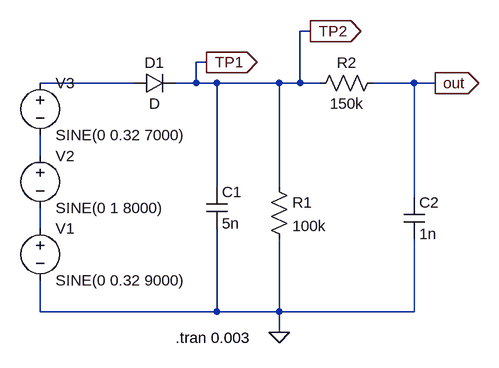
[diagram p0: schematic demodulator.asc]
demodulator.asc, the LTspice schematic file:
Version 4
SHEET 1 880 680
WIRE 544 -480 528 -480
WIRE 384 -432 368 -432
WIRE 272 -400 128 -400
WIRE 368 -400 368 -432
WIRE 368 -400 336 -400
WIRE 400 -400 368 -400
WIRE 496 -400 400 -400
WIRE 528 -400 528 -480
WIRE 528 -400 496 -400
WIRE 560 -400 528 -400
WIRE 704 -400 640 -400
WIRE 736 -400 704 -400
WIRE 128 -288 128 -320
WIRE 400 -240 400 -400
WIRE 496 -240 496 -400
WIRE 704 -224 704 -400
WIRE 128 -176 128 -208
WIRE 128 -48 128 -96
WIRE 400 -48 400 -176
WIRE 400 -48 128 -48
WIRE 496 -48 496 -160
WIRE 496 -48 400 -48
WIRE 704 -48 704 -160
WIRE 704 -48 496 -48
WIRE 496 -16 496 -48
FLAG 384 -432 TP1
IOPIN 384 -432 Out
FLAG 544 -480 TP2
IOPIN 544 -480 Out
FLAG 736 -400 out
IOPIN 736 -400 Out
FLAG 496 -16 0
SYMBOL voltage 128 -192 R0
WINDOW 123 0 0 Left 0
WINDOW 39 0 0 Left 0
SYMATTR InstName V1
SYMATTR Value SINE(0 0.32 9000)
SYMBOL voltage 128 -304 R0
WINDOW 123 0 0 Left 0
WINDOW 39 0 0 Left 0
SYMATTR InstName V2
SYMATTR Value SINE(0 1 8000)
SYMBOL voltage 128 -416 R0
WINDOW 123 0 0 Left 0
WINDOW 39 0 0 Left 0
SYMATTR InstName V3
SYMATTR Value SINE(0 0.32 7000)
SYMBOL cap 384 -240 R0
SYMATTR InstName C1
SYMATTR Value 5n
SYMBOL res 480 -256 R0
SYMATTR InstName R1
SYMATTR Value 100k
SYMBOL diode 272 -384 R270
WINDOW 0 32 32 VTop 2
WINDOW 3 0 32 VBottom 2
SYMATTR InstName D1
SYMBOL res 656 -416 R90
WINDOW 0 0 56 VBottom 2
WINDOW 3 32 56 VTop 2
SYMATTR InstName R2
SYMATTR Value 150k
SYMBOL cap 688 -224 R0
SYMATTR InstName C2
SYMATTR Value 1n
TEXT 336 -8 Left 2 !.tran 0.003

The netlist it stands for:
* demodulator.asc
V1 N003 0 SINE(0 0.32 9000)
V2 N002 N003 SINE(0 1 8000)
V3 N001 N002 SINE(0 0.32 7000)
C1 TP2 0 5n
R1 TP2 0 100k
D1 N001 TP2 D
R2 out TP2 150k
C2 out 0 1n
.model D D
.lib standard.dio
.tran 0.003
.backanno
.end